# EAGLE design em406 breakout-v10 (EAGLE 5.01)
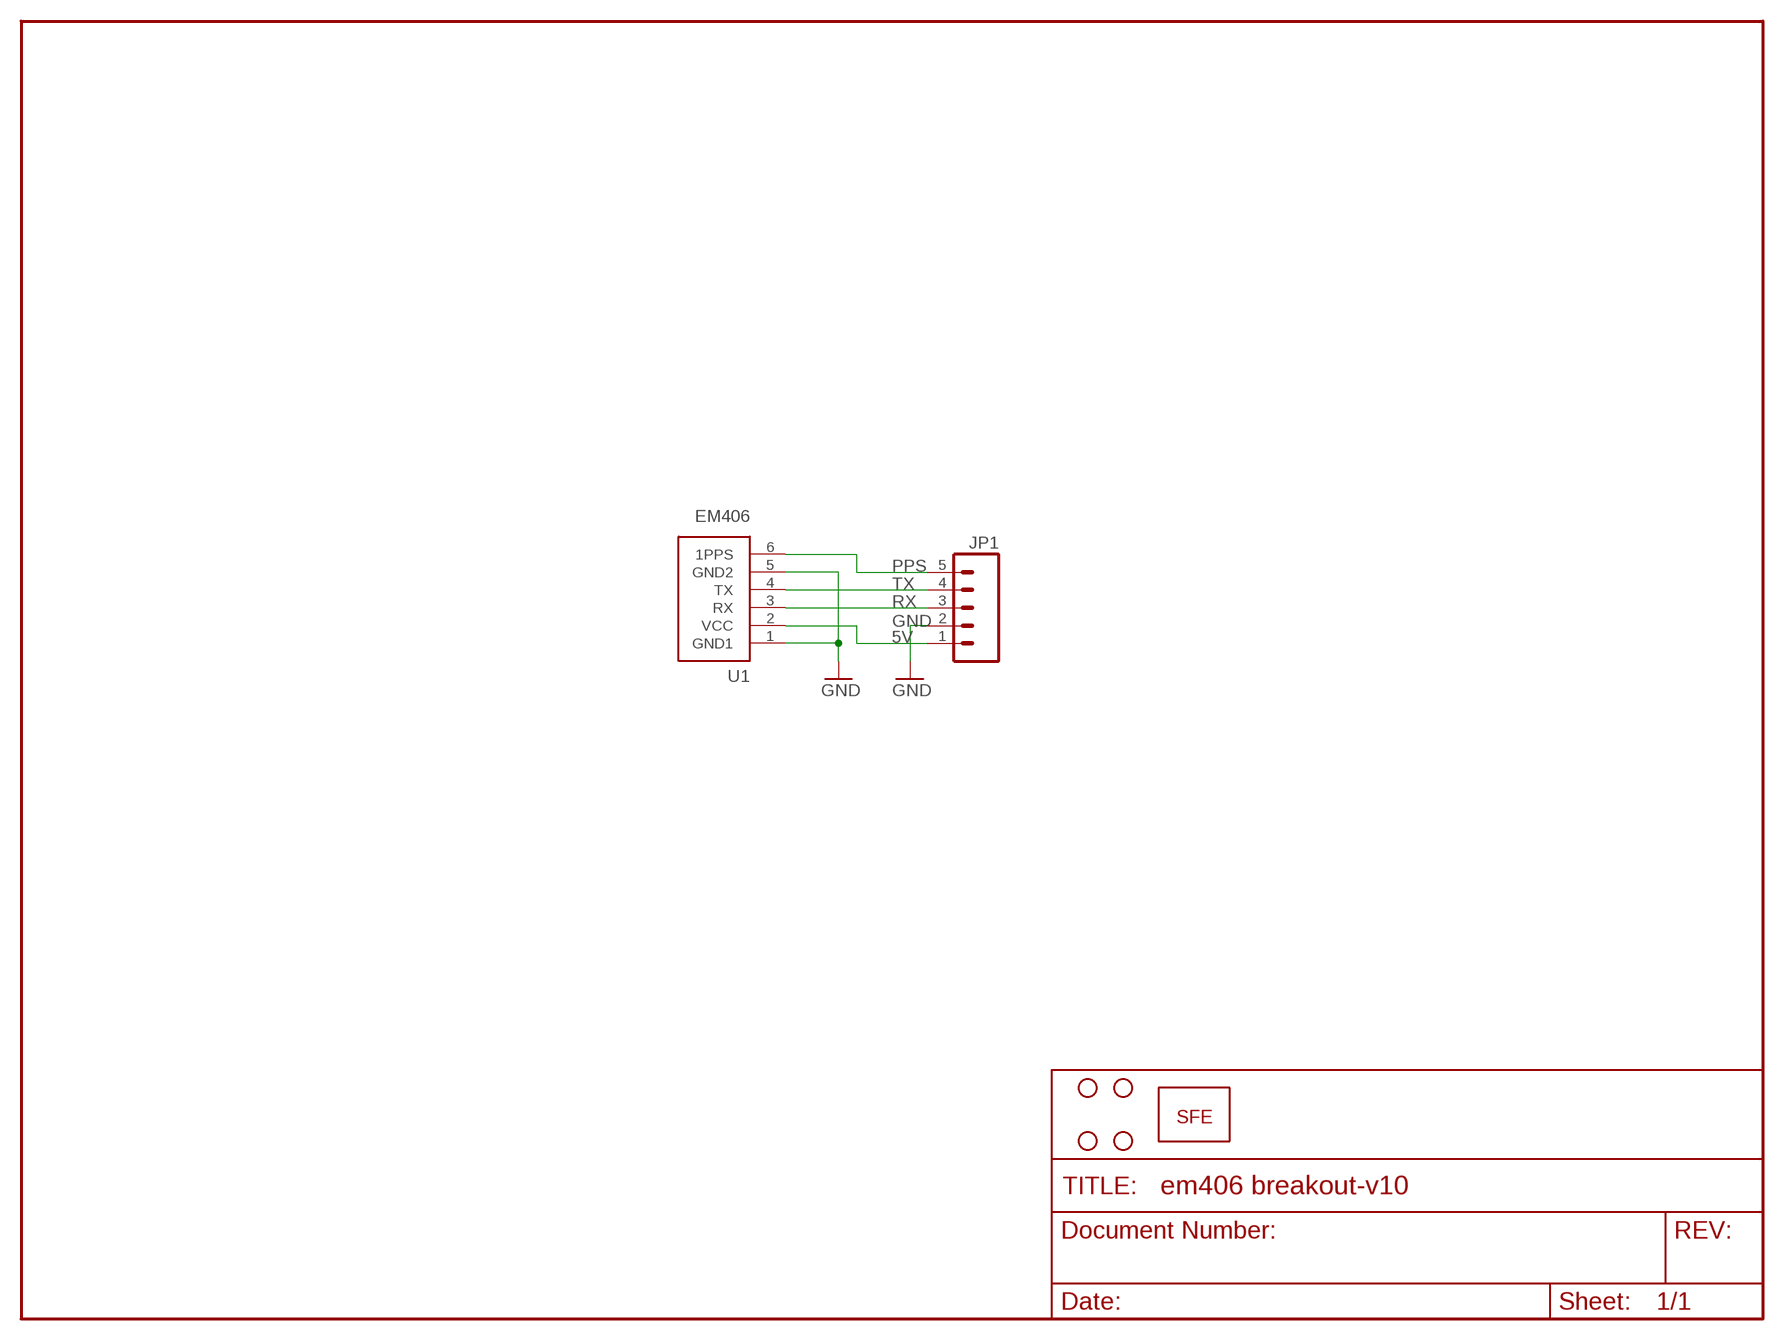
[diagram p0: schematic, sheet 1]

## Parts
JP1  M05PTH  [1X05]
JP3  STAND-OFF  [STAND-OFF]
JP4  STAND-OFF  [STAND-OFF]
JP5  STAND-OFF  [STAND-OFF]
JP6  STAND-OFF  [STAND-OFF]
JP7  LOGO-SFESK  [SFE-LOGO-FLAME]
U1  EM406  [EM406]

## Nets
5V: JP1.1 U1.2(VCC)
GND: JP1.2 U1.1(GND1) U1.5(GND2)
PPS: JP1.5 U1.6(1PPS)
RX: JP1.3 U1.3(RX)
TX: JP1.4 U1.4(TX)

## Library data of the parts
JP1 = SparkFun:M05: Header 5 Standard 5-pin 0.1" header. Use with straight break away headers (SKU : PRT-00116), right angle break away headers (PRT-00553), swiss pins (PRT-00743), machine pins (PRT-00117), and female headers (PRT-00115). Molex polarized connector foot print use with SKU : PRT-08230 with associated crimp pins and housings.
JP3-JP6 = SparkFun:STAND-OFF: Stand Off This is the mechanical footprint for a #4 phillips button head screw. Use the keepout ring to avoid running the screw head into surrounding components. SKU : PRT-00447
JP7 = SparkFun:LOGO-SFE: Spark Fun Electronics PCB Logo This is the standard Spark Fun Electronics PCB logo.
U1 = SparkFun:EM406: EM406 Connector Proven layout and schematic for EM406 connector. Spark Fun Electronics SKU : GPS-00579

## Board
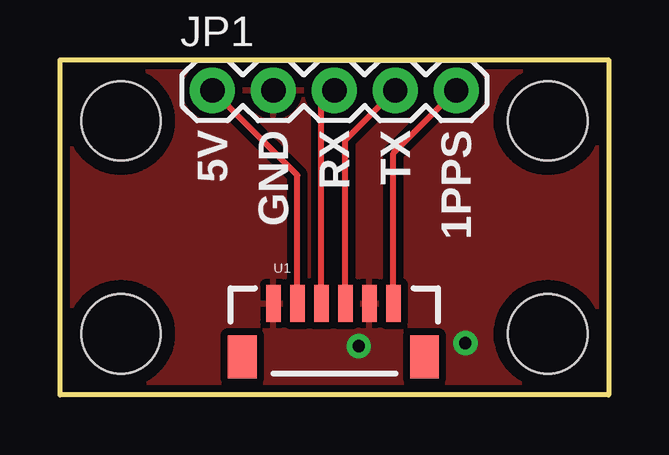
[diagram p1: board, top side]
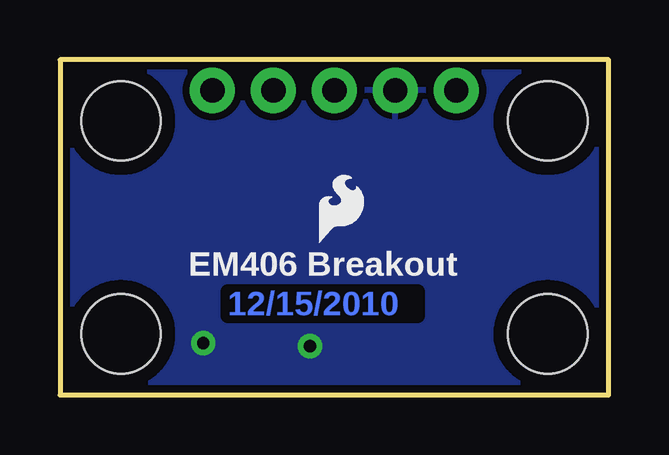
[diagram p2: board, bottom side, seen from below]

Size 22.86 x 13.97 mm. Coordinates in mm from the lower left corner, seen from the top.
Outline: 0,0 0,13.97 22.86,13.97 22.86,0 0,0
Copper layers (1*16): Top 0.035mm / dielectric 1.5mm / Bottom 0.035mm
Design rules "SparkFun": minimum track width 8mil, minimum drill 20mil, track to track 8mil, track to pad 8mil, pad to pad 8mil, via to via 8mil, smd to smd 8mil, copper to edge 8mil, drill to drill 8mil, minimum pad ring 12mil, minimum via ring 10mil, stop-mask expansion 4mil, vias tented up to drill 20mil, thermal gap 10mil

### Footprints (pad centres in the part's own frame; a part is rotated, then mirrored left to right if it is on the bottom)
1X05 = drill 1.016 pad 1.88 round: 1 0,0; 2 2.54,0; 3 5.08,0; 4 7.62,0; 5 10.16,0
STAND-OFF = hole 3.302: 0,0
EM406 = smd 0.6 x 1.55: 1 0,0; 2 1,0; 3 2,0; 4 3,0; 5 4,0; 6 5,0 | smd 1.2 x 1.8: P$1 -1.3,-2.225; P$2 6.3,-2.225

### Placement (x,y rotation side)
JP1  6.35,12.7 0 top
JP3  20.32,11.43 0 top
JP4  2.54,11.43 0 top
JP5  2.54,2.54 0 top
JP6  20.32,2.54 0 top
JP7  12.07,6.35 0 bottom
U1  8.89,3.81 0 top

### Tracks (layer width: path | path; a pad name or v marks a point on that pad's centre or on a via)
5V
  Top 0.254: U1.2 9.89,9.16 JP1.1
GND  (via drill 0.51)
  other vias: 12.45,2.03 16.89,2.16
  pour Bottom (isolate 0.305): 0,0 0,13.97 22.86,13.97 22.86,0
  pour Top (isolate 0.305): 0,0 0,13.97 22.86,13.97 22.86,0
PPS
  Top 0.254: U1.6 13.89,10.08 JP1.5
RX
  Top 0.254: U1.3 10.89,12.16 JP1.3
TX
  Top 0.254: U1.4 11.89,10.62 JP1.4

### Text on the board
Bottom: 12/15/2010
tPlace: 5V | GND | RX | TX | 1PPS
bPlace: EM406 Breakout